# EAGLE design redashboard_rp2040 (EAGLE 9.6.2)
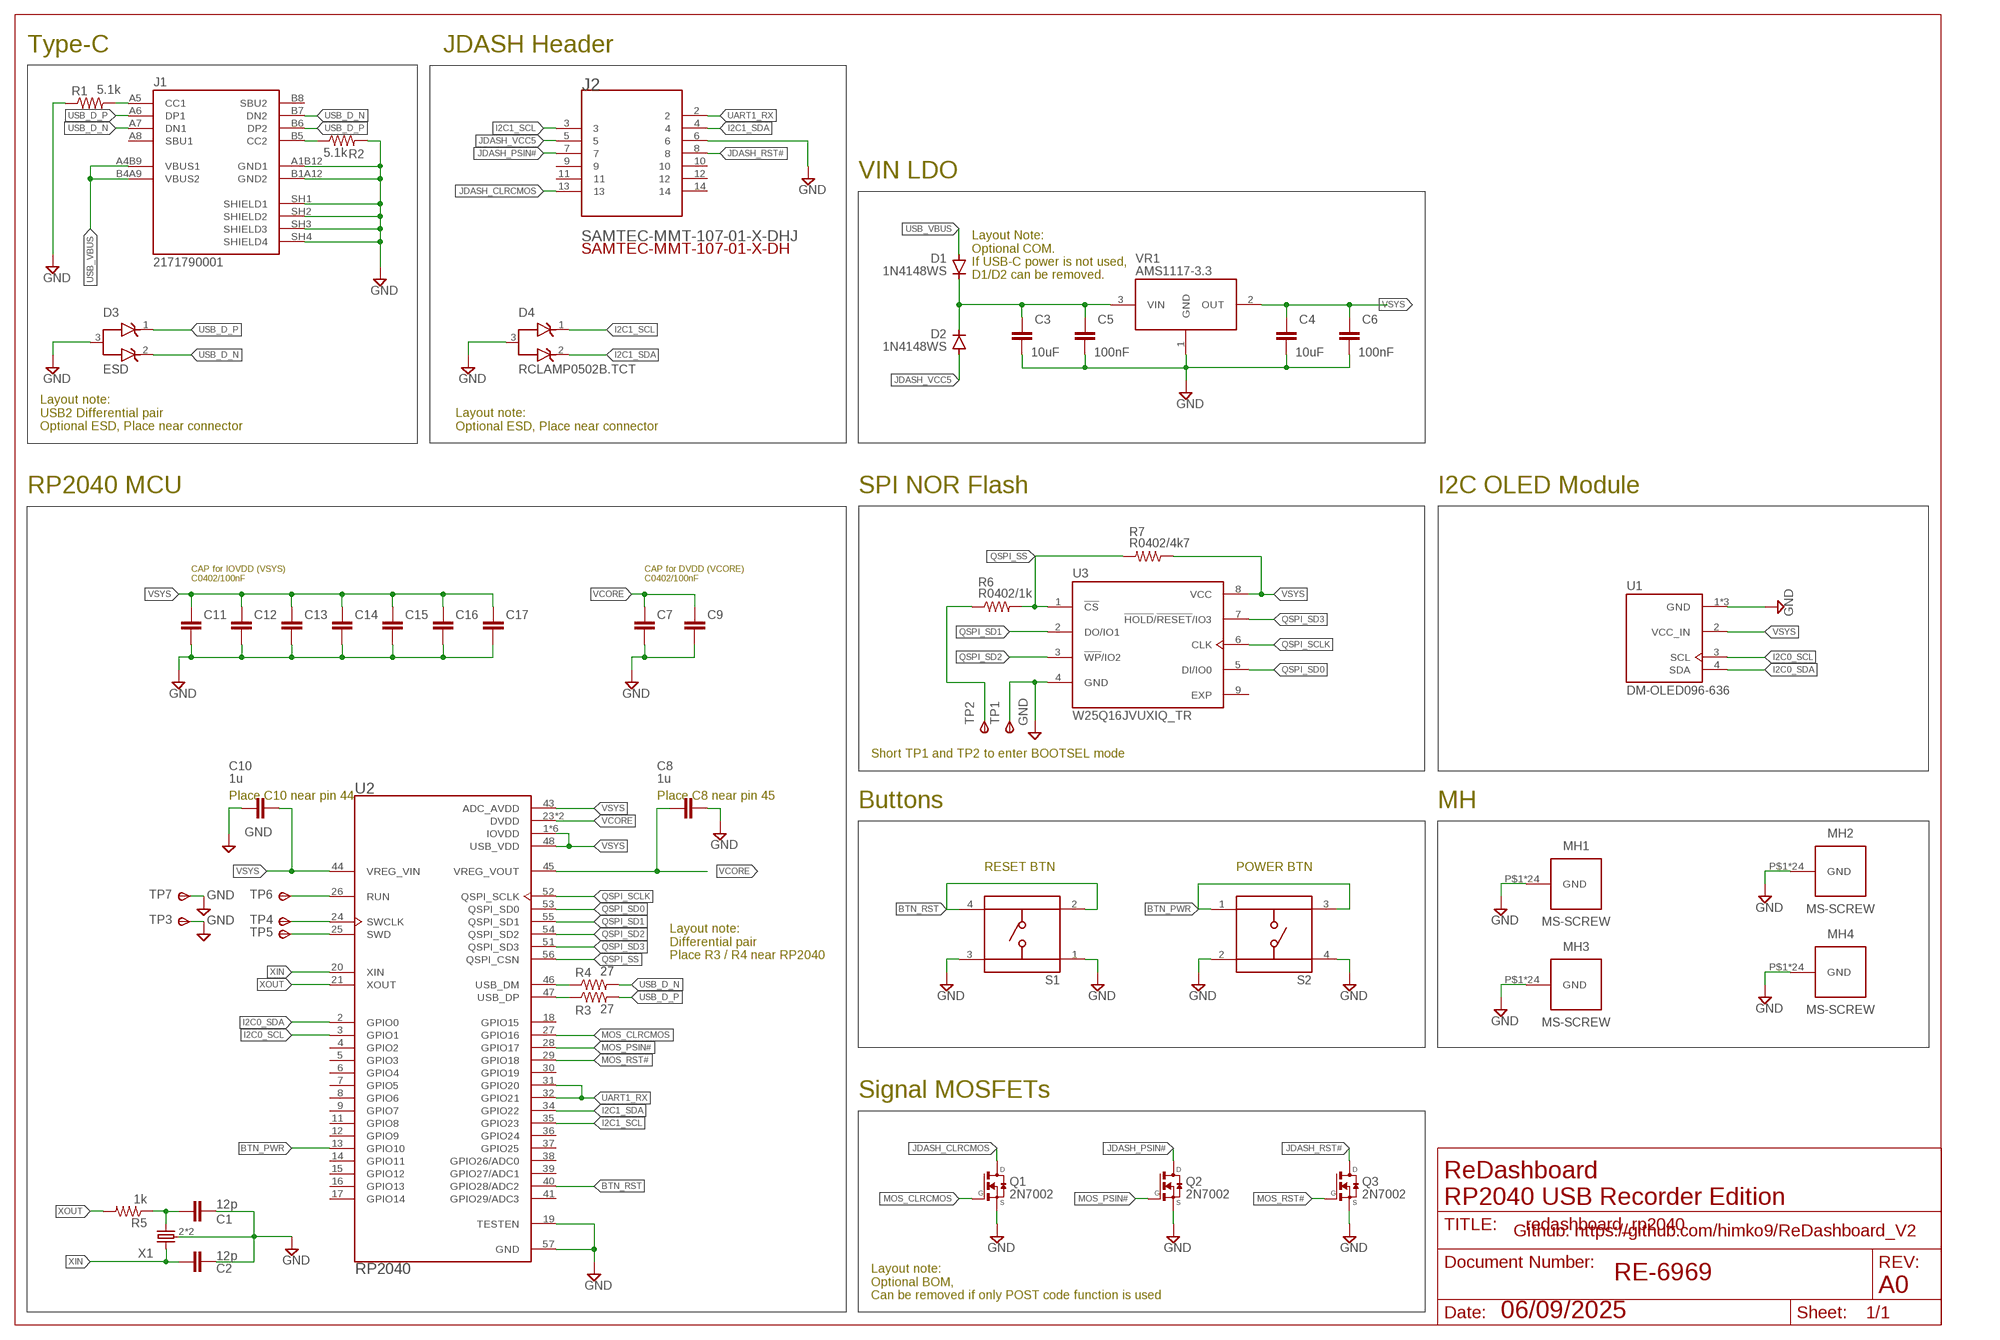
[diagram p0: schematic, sheet 1]

## Parts
C1  12p  CC0402JRNPO9BN100  [CAP_0402]
C2  12p  CC0402JRNPO9BN100  [CAP_0402]
C3  10uF  CC0603JRNPO9BN270  [CAP_0603]
C4  10uF  CC0603JRNPO9BN270  [CAP_0603]
C5  100nF  CC0402CRNPO9BN1R0  [CAP_0402]
C6  100nF  CC0402CRNPO9BN1R0  [CAP_0402]
C7  100nF  CC0402CRNPO9BN1R0  [CAP_0402]
C8  1u  CC0402CRNPO9BN1R0  [CAP_0402]
C9  CC0402CRNPO9BN1R0  [CAP_0402]
C10  1u  CC0402CRNPO9BN1R0  [CAP_0402]
C11  100nF  CC0402CRNPO9BN1R0  [CAP_0402]
C12  100nF  CC0402CRNPO9BN1R0  [CAP_0402]
C13  100nF  CC0402CRNPO9BN1R0  [CAP_0402]
C14  100nF  CC0402CRNPO9BN1R0  [CAP_0402]
C15  100nF  CC0402CRNPO9BN1R0  [CAP_0402]
C16  100nF  CC0402CRNPO9BN1R0  [CAP_0402]
C17  100nF  CC0402CRNPO9BN1R0  [CAP_0402]
D1  1N4148WS  [SOD-323]
D2  1N4148WS  [SOD-323]
D3  ESD  RCLAMP0502B.TCT  [TVS_RCLAMP0502B.TCT]
D4  RCLAMP0502B.TCT  [TVS_RCLAMP0502B.TCT]
J1  2171790001  [MOLEX_2171790001]
J2  SAMTEC-MMT-107-01-X-DHJ  [SAMTEC-MMT-107-01-X-DH]
MH1  MS-SCREW  [MS-SCREW]
MH2  MS-SCREW  [MS-SCREW]
MH3  MS-SCREW  [MS-SCREW]
MH4  MS-SCREW  [MS-SCREW]
Q1  2N7002  TRANSISTOR-FET_DMN2004K  [TRANSISTOR-FET_SOT23]
Q2  2N7002  TRANSISTOR-FET_DMN2004K  [TRANSISTOR-FET_SOT23]
Q3  2N7002  TRANSISTOR-FET_DMN2004K  [TRANSISTOR-FET_SOT23]
R1  5.1k  RC0402JR-070RL  [RES_0402]
R2  5.1k  RC0402JR-070RL  [RES_0402]
R3  27  RC0402JR-070RL  [RES_0402]
R4  27  RC0402JR-070RL  [RES_0402]
R5  1k  RC0402JR-070RL  [RES_0402]
R6  R0402/1k  RC0402JR-070RL  [RES_0402]
R7  R0402/4k7  RC0402JR-070RL  [RES_0402]
S1  TS04-66-50-BK-260-SMT  [SW_TS04-66-50-BK-260-SMT]
S2  TS04-66-50-BK-260-SMT  [SW_TS04-66-50-BK-260-SMT]
TP1  TPSTP10SQ  [TP10SQ]
TP2  TPSTP10R  [TP10R]
TP3  TPSTP10SQ  [TP10SQ]
TP4  TPSTP10R  [TP10R]
TP5  TPSTP10R  [TP10R]
TP6  TPSTP10R  [TP10R]
TP7  TPSTP10SQ  [TP10SQ]
U1  DM-OLED096-636  [MODULE_DM-OLED096-636]
U2  RP2040  [QFN40P700X700X90-57N]
U3  W25Q16JVUXIQ_TR  [IC_W25Q16JVUXIQ_TR]
VR1  AMS1117-3.3  AZ1117CR2-5.0TRG1  [VREG_AZ1117CR2-5.0TRG1]
X1  KX-6  [2.5X2.0_KX-6]

## Nets
BTN_PWR: S2.1 S2.3 U2.13(GPIO10)
BTN_RST: S1.2 S1.4 U2.40(GPIO28/ADC2)
GND: C1.2 C2.2 C3.2 C4.2 C5.2 C6.2 C7.2 C8.2 C9.2 C10.1 C11.2 C12.2 C13.2 C14.2 C15.2 C16.2 C17.2 D3.3(A) D4.3(A) J1.A1B12(GND1) J1.B1A12(GND2) J1.SH1(SHIELD1) J1.SH2(SHIELD2) J1.SH3(SHIELD3) J1.SH4(SHIELD4) J2.6 MH1.P$1(GND) MH1.P$2(GND) MH1.P$3(GND) MH1.P$4(GND) MH1.P$5(GND) MH1.P$6(GND) MH1.P$7(GND) MH1.P$8(GND) MH1.P$9(GND) MH1.P$10(GND) MH1.P$11(GND) MH1.P$12(GND) MH1.P$13(GND) MH1.P$14(GND) MH1.P$15(GND) MH1.P$16(GND) MH1.P$17(GND) MH1.P$18(GND) MH1.P$19(GND) MH1.P$20(GND) MH1.P$21(GND) MH1.P$22(GND) MH1.P$23(GND) MH1.P$24(GND) MH2.P$1(GND) MH2.P$2(GND) MH2.P$3(GND) MH2.P$4(GND) MH2.P$5(GND) MH2.P$6(GND) MH2.P$7(GND) MH2.P$8(GND) MH2.P$9(GND) MH2.P$10(GND) MH2.P$11(GND) MH2.P$12(GND) MH2.P$13(GND) MH2.P$14(GND) MH2.P$15(GND) MH2.P$16(GND) MH2.P$17(GND) MH2.P$18(GND) MH2.P$19(GND) MH2.P$20(GND) MH2.P$21(GND) MH2.P$22(GND) MH2.P$23(GND) MH2.P$24(GND) MH3.P$1(GND) MH3.P$2(GND) MH3.P$3(GND) MH3.P$4(GND) MH3.P$5(GND) MH3.P$6(GND) MH3.P$7(GND) MH3.P$8(GND) MH3.P$9(GND) MH3.P$10(GND) MH3.P$11(GND) MH3.P$12(GND) MH3.P$13(GND) MH3.P$14(GND) MH3.P$15(GND) MH3.P$16(GND) MH3.P$17(GND) MH3.P$18(GND) MH3.P$19(GND) MH3.P$20(GND) MH3.P$21(GND) MH3.P$22(GND) MH3.P$23(GND) MH3.P$24(GND) MH4.P$1(GND) MH4.P$2(GND) MH4.P$3(GND) MH4.P$4(GND) MH4.P$5(GND) MH4.P$6(GND) MH4.P$7(GND) MH4.P$8(GND) MH4.P$9(GND) MH4.P$10(GND) MH4.P$11(GND) MH4.P$12(GND) MH4.P$13(GND) MH4.P$14(GND) MH4.P$15(GND) MH4.P$16(GND) MH4.P$17(GND) MH4.P$18(GND) MH4.P$19(GND) MH4.P$20(GND) MH4.P$21(GND) MH4.P$22(GND) MH4.P$23(GND) MH4.P$24(GND) Q1.2(S) Q2.2(S) Q3.2(S) R1.1 R2.2 S1.1 S1.3 S2.2 S2.4 TP1.TP(PP) TP3.TP(PP) TP7.TP(PP) U1.1(GND) U1.S3(GND) U1.S4(GND) U2.19(TESTEN) U2.57(GND) U3.4(GND) VR1.1(GND) X1.2 X1.4
I2C0_SCL: U1.3(SCL) U2.3(GPIO1)
I2C0_SDA: U1.4(SDA) U2.2(GPIO0)
I2C1_SCL: D4.1(K1) J2.3 U2.35(GPIO23)
I2C1_SDA: D4.2(K2) J2.4 U2.34(GPIO22)
JDASH_CLRCMOS: J2.13 Q1.3(D)
JDASH_PSIN#: J2.7 Q2.3(D)
JDASH_RST#: J2.8 Q3.3(D)
JDASH_VCC5: D2.A J2.5
MOS_CLRCMOS: Q1.1(G) U2.27(GPIO16)
MOS_PSIN#: Q2.1(G) U2.28(GPIO17)
MOS_RST#: Q3.1(G) U2.29(GPIO18)
N$1: R6.1 TP2.TP(PP)
N$2: C3.1 C5.1 D1.C D2.C VR1.3(VIN)
N$3: J1.B5(CC2) R2.1
N$4: C1.1 R5.1 X1.3
N$5: J1.A5(CC1) R1.2
N$9: TP6.TP(PP) U2.26(RUN)
N$10: TP4.TP(PP) U2.24(SWCLK)
N$11: TP5.TP(PP) U2.25(SWD)
QSPI_SCLK: U2.52(QSPI_SCLK) U3.6(CLK)
QSPI_SD0: U2.53(QSPI_SD0) U3.5(DI/IO0)
QSPI_SD1: U2.55(QSPI_SD1) U3.2(DO/IO1)
QSPI_SD2: U2.54(QSPI_SD2) U3.3(!WP!/IO2)
QSPI_SD3: U2.51(QSPI_SD3) U3.7(!HOLD!/!RESET!/IO3)
QSPI_SS: R6.2 R7.2 U2.56(QSPI_CSN) U3.1(!CS)
UART1_RX: J2.2 U2.31(GPIO20) U2.32(GPIO21)
USB_D_N: D3.2(K2) J1.A7(DN1) J1.B7(DN2) R4.2
USB_D_P: D3.1(K1) J1.A6(DP1) J1.B6(DP2) R3.2
USB_D_R_N: R4.1 U2.46(USB_DM)
USB_D_R_P: R3.1 U2.47(USB_DP)
USB_VBUS: D1.A J1.A4B9(VBUS1) J1.B4A9(VBUS2)
VCORE: C7.1 C8.1 C9.1 U2.23(DVDD) U2.45(VREG_VOUT) U2.50(DVDD)
VSYS: C4.1 C6.1 C10.2 C11.1 C12.1 C13.1 C14.1 C15.1 C16.1 C17.1 R7.1 U1.2(VCC_IN) U2.1(IOVDD) U2.10(IOVDD) U2.22(IOVDD) U2.33(IOVDD) U2.42(IOVDD) U2.43(ADC_AVDD) U2.44(VREG_VIN) U2.48(USB_VDD) U2.49(IOVDD) U3.8(VCC) VR1.2(OUT)
XIN: C2.1 U2.20(XIN) X1.1
XOUT: R5.2 U2.21(XOUT)
Unconnected: J1.A8(SBU1) J1.B8(SBU2) J2.9 J2.10 J2.11 J2.12 J2.14 U2.4(GPIO2) U2.5(GPIO3) U2.6(GPIO4) U2.7(GPIO5) U2.8(GPIO6) U2.9(GPIO7) U2.11(GPIO8) U2.12(GPIO9) U2.14(GPIO11) U2.15(GPIO12) U2.16(GPIO13) U2.17(GPIO14) U2.18(GPIO15) U2.30(GPIO19) U2.36(GPIO24) U2.37(GPIO25) U2.38(GPIO26/ADC0) U2.39(GPIO27/ADC1) U2.41(GPIO29/ADC3) U3.9(EXP)

## Notes on the sheet
- Type-C | JDASH Header
- VIN LDO
- Layout Note:
  Optional COM.
  If USB-C power is not used,
  D1/D2 can be removed.
- Layout note: 
  USB2 Differential pair
  Optional ESD, Place near connector
- Layout note: 
  Optional ESD, Place near connector
- RP2040 MCU | SPI NOR Flash | I2C OLED Module
- CAP for IOVDD (VSYS) | CAP for DVDD (VCORE)
- C0402/100nF | C0402/100nF
- Short TP1 and TP2 to enter BOOTSEL mode
- Place C10 near pin 44 | Place C8 near pin 45
- Buttons | MH
- RESET BTN | POWER BTN
- Layout note: 
  Differential pair
  Place R3 / R4 near RP2040
- Signal MOSFETs
- ReDashboard 
  RP2040 USB Recorder Edition
- Github: https://github.com/himko9/ReDashboard_V2
- RE-6969
- A0
- Layout note: 
  Optional BOM, 
  Can be removed if only POST code function is used
- 06/09/2025

## Library data of the parts
C1 C2 = Resistor_Capacitor:CC0402JRNPO9BN100: CAP CER 10PF 50V C0G/NPO 0402 Manufacturer's datasheet <http://www.yageo.com/documents/recent/UPY-GP_NP0_16V-to-50V_16.pdf>; CREATED_BY: PCBLayout.com; DIGIKEY_PART_NUMBER: 311-1014-2-ND; MANUFACTURER: Yageo; MPN: CC0402JRNPO9BN100; PACKAGE: SMD 0402
C3 C4 = Resistor_Capacitor:CC0603JRNPO9BN270: CAP CER 27PF 50V C0G/NPO 0603 Manufacturer's datasheet <http://www.yageo.com/documents/recent/UPY-GP_NP0_16V-to-50V_16.pdf>; CREATED_BY: PCBLayout.com; DIGIKEY_PART_NUMBER: 311-1063-2-ND; MANUFACTURER: Yageo; MPN: CC0603JRNPO9BN270; PACKAGE: SMD 0603
C5-C17 = Resistor_Capacitor:CC0402CRNPO9BN1R0: CAP CER 1PF 50V C0G/NPO 0402 Manufacturer's datasheet <http://www.yageo.com/documents/recent/UPY-GP_NP0_16V-to-50V_16.pdf>; CREATED_BY: PCBLayout.com; DIGIKEY_PART_NUMBER: 311-2076-2-ND; MANUFACTURER: Yageo; MPN: CC0402CRNPO9BN1R0; PACKAGE: SMD 0402
D1 D2 = Diodes:1N4148WS: DIODE GEN PURP 75V 150MA SOD323F Manufacturer's datasheet <https://www.onsemi.com/pub/Collateral/1N914BWS-D.pdf>; CREATED_BY: PCBLayout.com; DIGIKEY_PART_NUMBER: 1N4148WSFSTR-ND; MANUFACTURER: Diodes Incorporated; MPN: 1N4148WS; PACKAGE: SOD-323
D3 D4 = MSI_EZDashboard:RCLAMP0502B.TCT: Check availability <https://pricing.snapeda.com/parts/RCLAMP0502B.TCT/Semtech%20Corporation/view-part?ref=eda>; AVAILABILITY: In Stock; CHECK_PRICES: https://www.snapeda.com/parts/RCLAMP0502B.TCT/Semtech/view-part/?ref=eda; DESCRIPTION: 25V Clamp 5A (8/20µs) Ipp Tvs Diode Surface Mount SC-75 (SOT523); MF: Semtech Corporation; MP: RCLAMP0502B.TCT; PACKAGE: SC-75 Semtech; PRICE: None; SNAPEDA_LINK: https://www.snapeda.com/parts/RCLAMP0502B.TCT/Semtech/view-part/?ref=snap
J1 = MSI_EZDashboard:2171790001: Check availability <https://pricing.snapeda.com/parts/2171790001/Molex/view-part?ref=eda>; AVAILABILITY: In Stock; CHECK_PRICES: https://www.snapeda.com/parts/2171790001/Molex/view-part/?ref=eda; DESCRIPTION: Universal Serial Bus (USB) Shielded I/O Receptacle, Type C, Right-Angle, Surface Mount, Top Mount, Single Row, 16 Circuits, Gold (Au) Plating; MF: Molex; MP: 2171790001; PACKAGE: None; PRICE: None; SNAPEDA_LINK: https://www.snapeda.com/parts/2171790001/Molex/view-part/?ref=snap
J2 = MSI_EZDashboard:SAMTEC-MMT-107-01-X-DH: Check availability <https://pricing.snapeda.com/parts/MMT-107-01-S-DH-P-TR/Samtec/view-part?ref=eda>; AVAILABILITY: In Stock; CHECK_PRICES: https://www.snapeda.com/parts/MMT-107-01-S-DH-P-TR/Samtec/view-part/?ref=eda; DESCRIPTION: Connector Header Surface Mount, Right Angle 14 position 0.079 (2.00mm); MF: Samtec; MP: MMT-107-01-S-DH-P-TR; PACKAGE: None; PRICE: None; SNAPEDA_LINK: https://www.snapeda.com/parts/MMT-107-01-S-DH-P-TR/Samtec/view-part/?ref=snap
MH1-MH4 = MSI_EZDashboard:MS-SCREW
Q1-Q3 = 52101-101-REV-A_v16:TRANSISTOR-FET_DMN2004K: N-Channel Enhancement MOSFET
R1-R7 = Resistor_Capacitor:RC0402JR-070RL: RES SMD 0 OHM JUMPER 1/16W 0402 Manufacturer's datasheet <http://www.yageo.com/documents/recent/PYu-RC_Group_51_RoHS_L_10.pdf>; CREATED_BY: PCBLayout.com; DIGIKEY_PART_NUMBER: 311-0.0JRTR-ND; MANUFACTURER: Yageo; MPN: RC0402JR-070RL; PACKAGE: SMD 0402
S1 S2 = MSI_EZDashboard:TS04-66-50-BK-260-SMT: Check availability <https://pricing.snapeda.com/parts/TS04-66-50-BK-260-SMT/Same%20Sky/view-part?ref=eda>; AVAILABILITY: In Stock; CHECK_PRICES: https://www.snapeda.com/parts/TS04-66-50-BK-260-SMT/Same+Sky/view-part/?ref=eda; DESCRIPTION: 6 x 6 mm, 5 mm Actuator Height, 260 gf, Black, Surface Mount, SPST, Tactile Switch; MF: Same Sky; MP: TS04-66-50-BK-260-SMT; PACKAGE: None; PRICE: None; SNAPEDA_LINK: https://www.snapeda.com/parts/TS04-66-50-BK-260-SMT/Same+Sky/view-part/?ref=snap
TP1-TP7 = testpad:TPS: TEST PIN
U1 = MSI_EZDashboard:DM-OLED096-636: Check availability <https://pricing.snapeda.com/parts/DM-OLED096-636/Display%20Module/view-part?ref=eda>; AVAILABILITY: Not in stock; CHECK_PRICES: https://www.snapeda.com/parts/DM-OLED096-636/Display+Module/view-part/?ref=eda; DESCRIPTION: 0.96” 128 X 64 MONOCHROME GRAPHIC OLED DISPLAY MODULE - I2C; MF: Display Module; MP: DM-OLED096-636; PACKAGE: Package; PRICE: None; SNAPEDA_LINK: https://www.snapeda.com/parts/DM-OLED096-636/Display+Module/view-part/?ref=snap
U2 = MSI_EZDashboard:RP2040: Check availability <https://pricing.snapeda.com/parts/RP2040/Raspberry%20Pi/view-part?ref=eda>; AVAILABILITY: In Stock; CHECK_PRICES: https://www.snapeda.com/parts/RP2040/Raspberry+Pi/view-part/?ref=eda; DESCRIPTION: RP2040 chip for Raspberry Pi Pico - ARM® Cortex®-M0+ MCU 32-Bit; MF: Raspberry Pi; MP: RP2040; PACKAGE: None; PRICE: None; SNAPEDA_LINK: https://www.snapeda.com/parts/RP2040/Raspberry+Pi/view-part/?ref=snap
U3 = MSI_EZDashboard:W25Q16JVUXIQ_TR: Check availability <https://pricing.snapeda.com/parts/W25Q16JVUXIQ%20TR/Winbond/view-part?ref=eda>; AVAILABILITY: In Stock; CHECK_PRICES: https://www.snapeda.com/parts/W25Q16JVUXIQ%20TR/Winbond/view-part/?ref=eda; DESCRIPTION: NOR Flash Serial (SPI, Dual SPI, Quad SPI) 3V/3.3V 16M-bit 2M x 8 6ns 8-Pin USON EP T/R; MF: Winbond; MP: W25Q16JVUXIQ TR; PACKAGE: UFDFN-8 Winbond; PRICE: None; SNAPEDA_LINK: https://www.snapeda.com/parts/W25Q16JVUXIQ%20TR/Winbond/view-part/?ref=snap
VR1 = MSI_EZDashboard:AZ1117CR2-5.0TRG1: Check availability <https://pricing.snapeda.com/parts/AZ1117CR2-5.0TRG1/Diodes%20Zetex/view-part?ref=eda>; AVAILABILITY: In Stock; CHECK_PRICES: https://www.snapeda.com/parts/AZ1117CR2-5.0TRG1/Diodes+Inc./view-part/?ref=eda; DESCRIPTION: Linear Voltage Regulator IC Positive Fixed 1 Output 1A SOT-89-3; MF: Diodes Zetex; MP: AZ1117CR2-5.0TRG1; PACKAGE: None; PRICE: None; SNAPEDA_LINK: https://www.snapeda.com/parts/AZ1117CR2-5.0TRG1/Diodes+Inc./view-part/?ref=snap
X1 = MSI_EZDashboard:KX

## Board
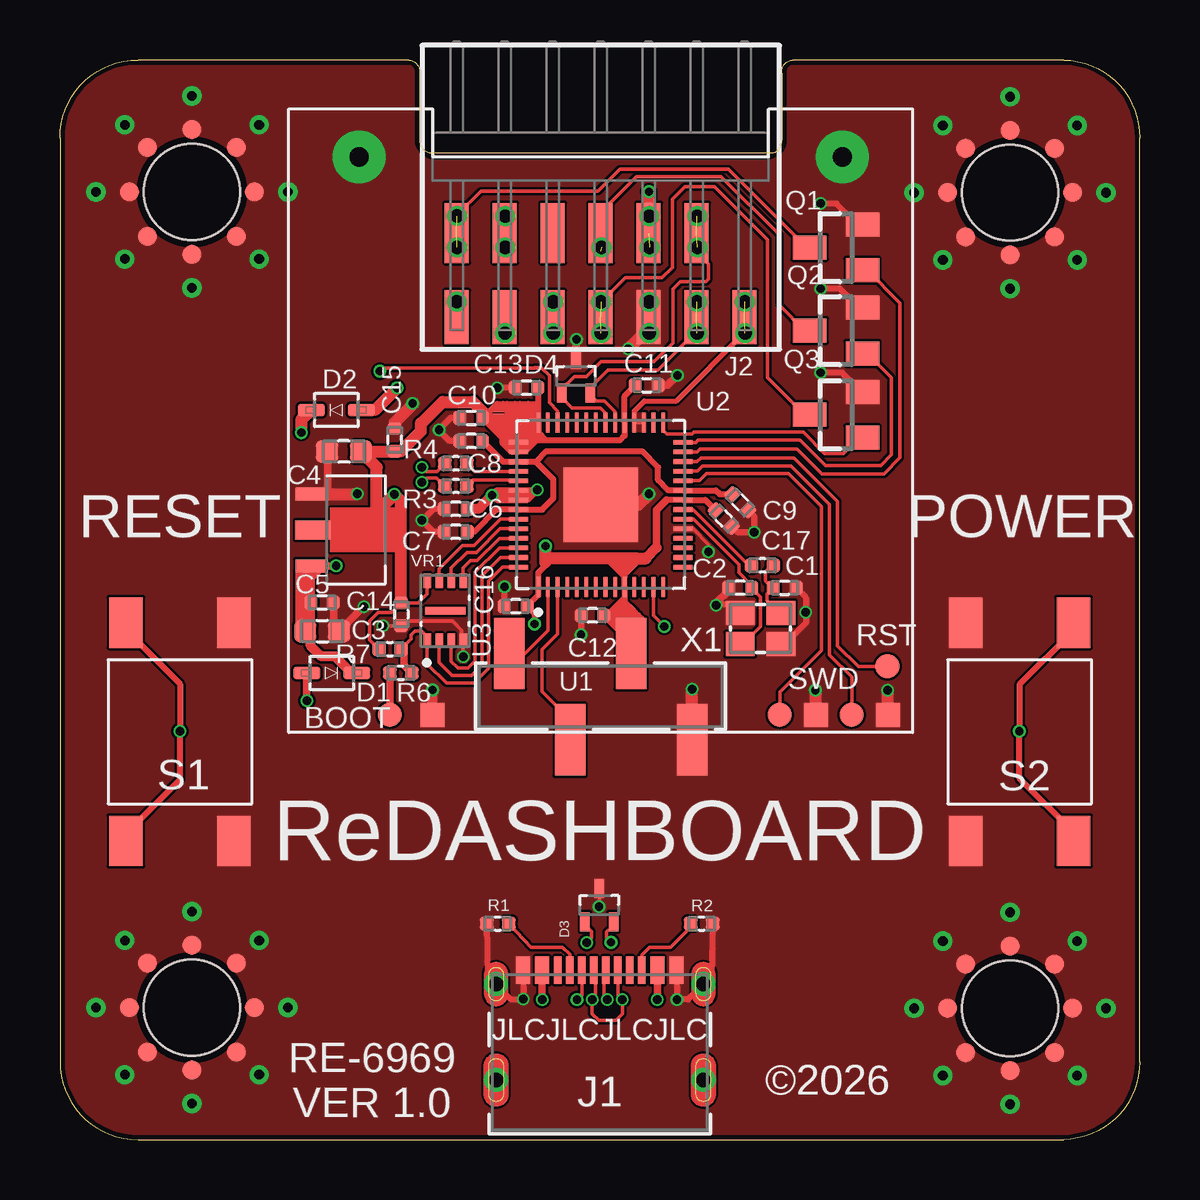
[diagram p1: board, top side]
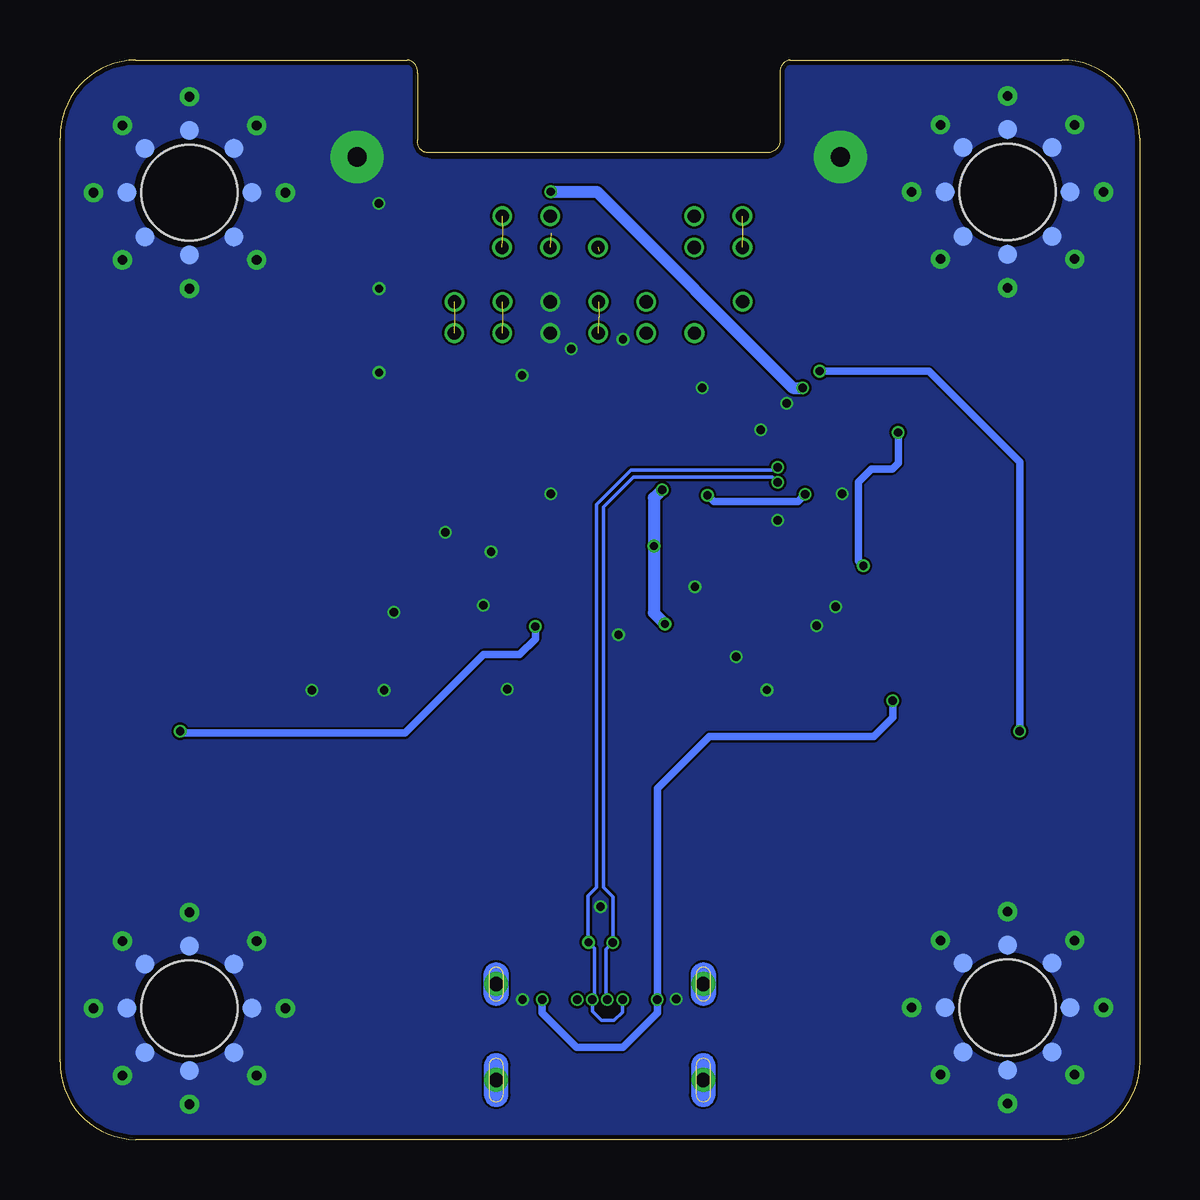
[diagram p2: board, bottom side, seen from below]

Size 45 x 45 mm. Coordinates in mm from the lower left corner, seen from the top.
Outline: 3.25,0 41.85,0 arc90 45,3.25 45,41.75 arc90 41.85,45 30.54,45 arc90 30.09,44.45 30.09,41.65 arc-90 29.69,41.13 15.49,41.13 arc-90 14.99,41.66 14.99,44.46 arc90 14.55,45 3.25,45 arc90 0,41.75 0,3.25 arc90 3.25,0
Copper layers (1*16): Top 0.035mm / dielectric 1.465mm / Bottom 0.035mm
Design rules "JLC0216 *": minimum track width 4mil, minimum drill 0.15mm, track to track 4mil, track to pad 4mil, pad to pad 4mil, via to via 4mil, smd to smd 4mil, copper to edge 0.2mm, drill to drill 6mil, minimum pad ring 2mil, minimum via ring 2mil, stop-mask expansion 0mil, vias tented up to drill 0mil, thermal gap 0mil

### Footprints (pad centres in the part's own frame; a part is rotated, then mirrored left to right if it is on the bottom)
CAP_0402 = smd 0.55 x 0.58: 1 -0.475,0; 2 0.475,0
CAP_0603 = smd 0.92 x 0.93: 1 -0.705,0; 2 0.705,0
SOD-323 = smd 1.14 x 0.52: A 1.04,0; C -1.04,0
TVS_RCLAMP0502B.TCT = smd 0.8 x 0.4: 1 -0.7,0.6; 2 -0.7,-0.6; 3 0.7,0
MOLEX_2171790001 = smd 0.59 x 1.15: A1B12 -3.2,3.425; A4B9 -2.4,3.425; B1A12 3.2,3.425; B4A9 2.4,3.425 | smd 0.298 x 1.15: A5 -1.25,3.425; A6 -0.25,3.425; A7 0.25,3.425; A8 1.25,3.425; B5 1.75,3.425; B6 0.75,3.425; B7 -0.75,3.425; B8 -1.75,3.425 | drill 0.6 pad 1: SH1 -4.32,-1.15; SH2 4.32,-1.15; SH3 -4.32,2.85; SH4 4.32,2.85
SAMTEC-MMT-107-01-X-DH = smd 1 x 2.25: 2 -6,6.68; 4 -4,6.68; 6 -2,6.68; 8 0,6.68; 10 2,6.68; 12 4,6.68; 14 6,6.68 | smd 1 x 2.5: 3 -4,3.175; 5 -2,3.175; 7 0,3.175; 9 2,3.175; 11 4,3.175; 13 6,3.175
MS-SCREW = drill 0.4 pad 0.8: P$1 0,-4; P$2 0,4; P$3 4,0; P$4 -2.8,2.8; P$5 -4,0; P$6 -2.8,-2.8; P$15 2.8,2.8; P$16 2.8,-2.8 | smd 0.8 x 0.8 bottom: P$7 0,2.6; P$8 0,-2.6; P$9 2.6,0; P$10 -1.85,1.85; P$11 1.85,1.85; P$12 -2.6,0; P$13 -1.85,-1.85; P$14 1.85,-1.85 | smd 0.8 x 0.8: P$17 0,2.6; P$18 1.85,1.85; P$19 2.6,0; P$20 1.85,-1.85; P$21 0,-2.6; P$22 -1.85,-1.85; P$23 -2.6,0; P$24 -1.85,1.85 | hole 4: 0,0
TRANSISTOR-FET_SOT23 = smd 1 x 1.4: 1 -0.95,-1.1; 2 0.95,-1.1; 3 0,1.1
RES_0402 = smd 0.58 x 0.58: 1 -0.46,0; 2 0.46,0
SW_TS04-66-50-BK-260-SMT = smd 2.1 x 1.4: 1 -4.55,2.25; 2 -4.55,-2.25; 3 4.55,2.25; 4 4.55,-2.25
TP10SQ = smd 1 x 1: TP 0,0
TP10R = smd 1 x 1: TP 0,0
MODULE_DM-OLED096-636 = smd 1.27 x 2.972: 1 -3.81,13.3; 2 -1.27,9.7; 3 1.27,13.3; 4 3.81,9.7 | drill 0.8 pad 2.2: S3 10.075,-11; S4 -10.075,-11
QFN40P700X700X90-57N = smd 0.84 x 0.2: 1 -3.435,2.6; 2 -3.435,2.2; 3 -3.435,1.8; 4 -3.435,1.4; 5 -3.435,1; 6 -3.435,0.6; 7 -3.435,0.2; 8 -3.435,-0.2; 9 -3.435,-0.6; 10 -3.435,-1; 11 -3.435,-1.4; 12 -3.435,-1.8; 13 -3.435,-2.2; 14 -3.435,-2.6; 29 3.435,-2.6; 30 3.435,-2.2; 31 3.435,-1.8; 32 3.435,-1.4; 33 3.435,-1; 34 3.435,-0.6; 35 3.435,-0.2; 36 3.435,0.2; 37 3.435,0.6; 38 3.435,1; 39 3.435,1.4; 40 3.435,1.8; 41 3.435,2.2; 42 3.435,2.6 | smd 0.2 x 0.84: 15 -2.6,-3.435; 16 -2.2,-3.435; 17 -1.8,-3.435; 18 -1.4,-3.435; 19 -1,-3.435; 20 -0.6,-3.435; 21 -0.2,-3.435; 22 0.2,-3.435; 23 0.6,-3.435; 24 1,-3.435; 25 1.4,-3.435; 26 1.8,-3.435; 27 2.2,-3.435; 28 2.6,-3.435; 43 2.6,3.435; 44 2.2,3.435; 45 1.8,3.435; 46 1.4,3.435; 47 1,3.435; 48 0.6,3.435; 49 0.2,3.435; 50 -0.2,3.435; 51 -0.6,3.435; 52 -1,3.435; 53 -1.4,3.435; 54 -1.8,3.435; 55 -2.2,3.435; 56 -2.6,3.435 | smd 3.1 x 3.1: 57 0,0
IC_W25Q16JVUXIQ_TR = smd 0.6 x 0.3: 1 -1.25,0.75; 2 -1.25,0.25; 3 -1.25,-0.25; 4 -1.25,-0.75; 5 1.25,-0.75; 6 1.25,-0.25; 7 1.25,0.25; 8 1.25,0.75 | smd 0.3 x 1.7: 9 0,0
VREG_AZ1117CR2-5.0TRG1 = smd 1.3 x 0.55: 1 -1.875,1.5; 3 -1.875,-1.5 | smd 1.475 x 0.8: 2 -1.788,0
2.5X2.0_KX-6 = smd 1.2 x 1: 1 -0.85,-0.65; 2 0.85,-0.65; 3 0.85,0.65; 4 -0.85,0.65

### Placement (x,y rotation side)
C1  30.21,23 0 top
C2  28.35,23 180 top
C3  10.93,21.19 0 top
C4  11.84,28.68 180 top
C5  10.93,22.39 0 top
C6  16.5,26.29 180 top
C7  16.5,25.33 180 top
C8  17.14,29.12 180 top
C9  28.35,26.56 315 top
C10  17.14,30.08 0 top
C11  24.46,31.44 0 top
C12  22.2,21.85 180 top
C13  19.45,31.34 180 top
C14  14.22,21.89 270 top
C15  13.95,29.16 90 top
C16  19,22.23 180 top
C17  27.67,25.89 315 top
D1  11.33,19.45 180 top
D2  11.52,30.41 0 top
D3  22.48,9.77 90 top
D4  21.51,31.82 90 top
J1  22.5,3.63 0 top
J2  22.54,40.96 180 top
MH1  5.5,5.5 0 top
MH2  5.5,39.5 0 top
MH3  39.6,5.47 0 top
MH4  39.6,39.47 0 top
Q1  32.35,37.18 90 top
Q2  32.35,33.72 90 top
Q3  32.35,30.21 90 top
R1  18.25,9 0 top
R2  26.75,9 0 top
R3  16.5,27.24 180 top
R4  16.5,28.18 180 top
R5  29.28,23.93 180 top
R6  14.21,19.45 0 top
R7  13.76,20.44 0 top
S1  5,17 270 top
S2  40,17 270 top
TP1  15.53,17.7 0 top
TP2  13.75,17.7 0 top
TP3  31.5,17.7 0 top
TP4  30,17.7 0 top
TP5  33,17.7 0 top
TP6  34.49,19.72 0 top
TP7  34.5,17.7 0 top
U1  22.54,29.96 180 top
U2  22.54,26.46 90 top
U3  16.06,22.04 90 top
VR1  12.34,25.41 0 top
X1  29.2,21.3 0 top

### Tracks (layer width: path | path; a pad name or v marks a point on that pad's centre or on a via)
BTN_PWR  (via drill 0.35 pad 0.45)
  Top 0.152: U2.13 24.74,21.84 v25.19,21.39 v25.18,21.39 | S2.1 42.25,21.22 | S2.3 42.25,12.8
  Top 0.254: 42.25,21.22 39.99,18.96 v39.99,17.02 39.99,15.06 42.25,12.8
  Bottom 0.305: v25.18,21.39 25.18,20.88 25.85,20.21 27.35,20.21 30.62,16.94 39.91,16.94 v39.99,17.02
BTN_RST  (via drill 0.35 pad 0.45)
  Top 0.152: 19.79,32.17 20.07,32.17 20.08,32.16 | 20.08,32.16 13.46,32.16 v13.34,32.04 v13.34,32.03 | U2.40 20.74,30.37 20.4,30.71 20.4,31.84 20.08,32.16 | S1.2 2.75,21.23 | S1.4 2.75,12.77
  Top 0.254: 2.75,21.23 5,18.98 v5,17.02 5,15.02 2.75,12.77
  Bottom 0.305: v13.34,32.03 8.79,32.03 5,28.24 v5,17.02
GND  (via drill 0.35 pad 0.45, 0.55)
  Top 0.152: v16.81,20.12 U3.4 16.74,20.86 16.74,21.22 16.36,21.61 14.41,21.61 C14.2 v13.46,21.41 | 11.4,20.96 C3.2 | U2.19 26.38,25.46 27.03,24.81 v27.03,24.5 | D3.3 v22.48,9.71 v22.47,9.7 | 30.21,20.65 X1.2
  Top 0.203: J2.6 24.54,33.81
  Top 0.254: J1.B1A12 v25.72,5.84 26.18,5.84 J1.SH4 27.16,6.82 R2.2 | J1.A1B12 v19.32,5.85 18.81,5.85 J1.SH3 17.83,6.83 R1.1 | C7.2 15.57,25.33 v15.09,25.81 15.57,26.29 C6.2 | C8.2 16.23,29.12 15.8,29.55 v15.8,29.59 16.29,30.08 C10.1 | C13.2 v18.23,31.34 | C15.2 13.95,29.89 | v14.7,30.68 14.7,30.64 | C16.2 v18.52,23.05 v18.53,23.05 | C17.2 28.24,25.32 v28.93,25.32 28.93,25.98 C9.2 | C12.2 v21.73,21.05 v21.72,21.05 | C1.2 31.09,22.59 v31.09,21.98 v31.1,21.97 31.1,21.54 30.21,20.65 | 28.38,22.04 28.1,22.31 27.35,22.31 v27.35,22.27 | Q1.2 33.26,38.13 32.37,39.02 v31.71,39.02 | Q2.2 33.31,34.67 32.51,35.47 v31.7,35.47 | Q3.2 33.41,31.16 32.6,31.97 v31.7,31.97
  Top 0.305: C11.2 25.33,31.44 v25.74,31.85 | C5.2 11.4,21.42 C3.2 v12.65,22.21 v12.66,22.21 | VR1.1 10.89,26.91 11.16,27.18 11.16,28.65 C4.2 | v31.5,18.72 v31.49,18.73 | C2.2 27.88,22.89 27.35,22.36 v27.35,22.27 | v21.53,33.35 21.51,33.33 D4.3
  Top 0.406: TP1.TP v15.53,18.74
  Top 0.508: 10.89,26.91 v12.39,26.91 | 14.7,30.64 13.95,29.89 | U1.1 v26.35,18.77 | TP3.TP v31.5,18.72 | 24.54,33.81 v23.68,32.95 | U2.57 24.1,26.46 v24.55,26.91 | TP7.TP v34.5,18.73
  other vias: 24.56,33.62 24.56,34.92
  pour Top: 3.26,0.14 arc-90 0.08,3.32 0.08,41.62 arc-90 3.35,44.89 14.47,44.89 arc-90 14.92,44.39 14.92,41.53 arc90 15.61,40.84 29.45,40.84 arc90 30.15,41.54 30.15,44.45 arc-90 30.53,44.86 41.87,44.86 arc-90 44.88,41.75 44.88,3.32 arc-90 41.8,0.14
  pour Bottom: 3.23,0.17 arc-90 0.05,3.35 0.05,41.65 arc-90 3.32,44.92 14.44,44.92 arc-90 14.89,44.42 14.89,41.56 arc90 15.58,40.87 29.42,40.87 arc90 30.12,41.57 30.12,44.48 arc-90 30.5,44.89 41.84,44.89 arc-90 44.85,41.78 44.85,3.35 arc-90 41.77,0.17
I2C0_SCL
  Top 0.152: U1.3 21.27,17.5 20.1,18.67 20.1,20.43 20.74,21.07 U2.3
I2C0_SDA
  Top 0.152: U2.2 20.34,21.22 19.38,20.26 U1.4
I2C1_SCL  (via drill 0.55)  (2 unrouted)
  Top 0.152: J2.3 26.54,36.98 27.03,36.49 27.03,35.87 26.93,35.77 25.87,35.77 25.55,35.45 25.55,33.2 24.77,32.42 22.56,32.42 21.95,31.81 21.44,31.81 20.91,31.28 D4.1 20.91,30.94 21.35,30.5 22.53,30.5 22.74,30.29 U2.35
  other vias: 26.56,38.49 26.57,37.19
I2C1_SDA  (via drill 0.55)  (2 unrouted)
  Top 0.152: J2.4 26.54,33.69 24.92,32.07 22.85,32.07 22.04,31.26 D4.2 22.07,31.09 22.37,30.79 22.7,30.79 23.14,30.35 U2.34
  other vias: 26.55,34.92 26.56,33.62
JDASH_CLRCMOS  (via drill 0.55)  (2 unrouted)
  Top 0.152: Q1.3 31.13,37.18 27.86,40.45 23.34,40.45 22.43,39.54 17.55,39.54 16.54,38.53 J2.13
  other vias: 16.55,37.19 16.55,38.5
JDASH_PSIN#  (via drill 0.55)  (1 unrouted)
  Top 0.152: Q2.3 31.04,33.72 29.98,34.78 29.98,37.71 27.56,40.13 24.04,40.13 22.54,38.63 J2.7 22.54,37.03
  other vias: 22.57,37.19
JDASH_RST#  (via drill 0.55)  (2 unrouted)
  Top 0.152: Q3.3 31.04,30.21 29.49,31.76 29.49,37.52 27.29,39.72 26.06,39.72 25.53,39.19 25.53,36.35 25.1,35.92 23.57,35.92 22.54,34.89 J2.8
  other vias: 22.55,34.92 22.56,33.62
JDASH_VCC5  (via drill 0.35 pad 0.45, 0.55)  (1 unrouted)
  Top 0.508: J2.5 24.56,37.8 v24.56,38.49 v24.56,39.5 v24.55,39.51 | v14.05,31.33 13.13,30.41 D2.A
  Bottom 0.508: v24.55,39.51 22.62,39.51 14.44,31.33 v14.05,31.33
  other vias: 24.57,37.19
MOS_CLRCMOS
  Top 0.152: U2.27 26.56,28.66 26.68,28.78 30.72,28.78 31.75,27.75 34.34,27.75 35.02,28.43 35.02,34.87 33.66,36.23 Q1.1
MOS_PSIN#
  Top 0.152: U2.28 26.51,29.06 26.6,29.15 30.85,29.15 31.9,28.1 34.21,28.1 34.66,28.55 34.66,31.76 33.65,32.77 Q2.1
MOS_RST#
  Top 0.152: U2.29 25.14,29.56 25.3,29.4 26.34,29.4 26.42,29.48 30.98,29.48 31.87,28.59 32.65,28.59 33.32,29.26 Q3.1
N$1
  Top 0.305: TP2.TP R6.1
N$2  (via drill 0.35 pad 0.45)
  Top 0.152: 10.46,20.96 C3.1 | C5.1 10.45,22.38 10.22,22.38
  Top 0.203: 10.22,23.1 11.04,23.91 v11.51,23.91
  Top 0.305: 10.22,23.1 10.32,23.1 | VR1.3 v11.51,23.91
  Top 0.406: D1.C 12.16,19.45 11.47,20.14 10.89,20.14 10.46,20.58 10.46,20.96
  Top 0.508: 10.22,23.67 VR1.3 | D2.C 10.06,29.99 v10.06,29.47
  Top 0.813: C3.1 10.22,22.38 10.22,23.1 10.22,23.67
  Bottom 0.305: v11.51,23.91 11.71,24.11 11.71,27.41 11.17,27.95 10.3,27.95 10.06,28.19 v10.06,29.47
N$3
  Top 0.152: J1.B5 24.25,7.69 24.57,8.01 25.45,8.01 26.29,8.85 R2.1
N$4
  Top 0.152: R5.1 29.66,23.93 29.41,23.68 29.41,23.29 29.7,23 C1.1 29.48,22.74 29.48,22.46 29.9,22.04 29.99,21.95 X1.3
N$5
  Top 0.152: R1.2 19.64,8.01 20.95,8.01 21.25,7.71 J1.A5
N$9
  Top 0.152: U2.26 26.56,28.26 26.71,28.41 30.6,28.41 32.41,26.6 32.41,20.58 33.27,19.72 TP6.TP
N$10
  Top 0.152: U2.24 26.65,27.46 26.95,27.76 30.36,27.76 31.73,26.39 31.73,20.38 30,18.65 TP4.TP
N$11
  Top 0.152: U2.25 26.57,27.86 26.79,28.08 30.47,28.08 32.08,26.47 32.08,20.2 33,19.28 TP5.TP
N$28  (via drill 0.55)
  other vias: 16.54,34.93
N$33  (via drill 0.55)
  other vias: 18.56,38.49
N$34  (via drill 0.55)
  other vias: 18.56,37.19
N$41  (via drill 0.55)
  other vias: 18.55,33.62
N$42  (via drill 0.55)
  other vias: 20.56,33.62
N$43  (via drill 0.55)
  other vias: 20.56,34.92
QSPI_SCLK
  Top 0.152: U2.52 18.34,25.46 17.36,24.48 16.97,24.48 16.31,23.82 U3.6
QSPI_SD0
  Top 0.152: U2.53 18.31,25.06 17.39,24.14 17.12,24.14 16.81,23.83 U3.5
QSPI_SD1
  Top 0.152: U2.55 18.36,24.27 17.6,23.51 17.6,19.79 17.16,19.35 16.35,19.35 15.81,19.89 U3.2
QSPI_SD2
  Top 0.152: U3.3 16.31,19.93 16.59,19.65 17.01,19.65 17.31,19.95 17.31,23.65 18.32,24.66 U2.54
QSPI_SD3
  Top 0.152: U3.7 15.81,23.79 16.79,24.77 17.27,24.77 18.37,25.87 19.09,25.87 U2.51
QSPI_SS
  Top 0.152: U2.56 18.44,23.86 17.87,23.29 17.87,19.63 17.27,19.03 16.11,19.03 15.31,19.83 U3.1 15.31,20.96 15.07,21.2 14.8,21.2 14.64,21.04 14.64,20.86 R7.2
  Top 0.305: R7.2 14.35,20.31 14.35,19.77 R6.2
UART1_RX  (via drill 0.55)  (2 unrouted)
  Top 0.152: U2.31 U2.32
  Top 0.203: U2.32 23.94,30.37 24.36,30.79 25.69,30.79 28.54,33.64 J2.2
  other vias: 28.55,34.92 28.56,33.62
  pour Top: 24.44,29.48 23.84,29.48 23.84,30.31 24.15,30.31 24.44,30.31
USB_D_N  (via drill 0.35 pad 0.45)
  Top 0.152: R4.2 15.71,27.85 15.27,27.85 v15.09,28.03 | J1.A7 22.75,6.59 22.67,6.52 22.67,5.98 v22.81,5.84 | J1.B7 21.75,6.04 v21.55,5.84 | D3.2 22.98,8.85 22.78,8.65 22.78,8.41 v22.97,8.22
  Bottom 0.152: v15.09,28.03 15.22,27.9 21.19,27.9 22.63,26.46 22.63,10.51 23,10.15 23,8.25 v22.97,8.22 22.72,7.97 22.72,5.93 v22.81,5.84 22.81,5.34 22.43,4.96 21.9,4.96 21.55,5.31 v21.55,5.84
USB_D_P  (via drill 0.35 pad 0.45)
  Top 0.152: R3.2 15.7,27.58 15.28,27.58 v15.09,27.39 | J1.A6 22.25,6.61 22.33,6.53 22.33,5.99 v22.18,5.84 22.18,5.24 22.46,4.96 23.17,4.96 23.44,5.23 v23.44,5.84 23.25,6.03 J1.B6 | D3.1 21.98,8.85 22.16,8.67 22.16,8.52 22.16,8.41 v21.96,8.21
  Bottom 0.152: v15.09,27.39 15.31,27.61 21.09,27.61 22.34,26.36 22.34,10.52 21.94,10.12 21.94,8.23 v21.96,8.21 22.24,7.93 22.24,5.9 v22.18,5.84
USB_D_R_N
  Top 0.152: R4.1 17.29,27.84 18.72,27.84 18.73,27.85 U2.46
USB_D_R_P
  Top 0.152: R3.1 17.2,27.48 18.7,27.48 18.73,27.45 U2.47
USB_VBUS  (via drill 0.35 pad 0.45)
  Top 0.305: v10.29,18.29 D1.A | J1.A4B9 v20.1,5.84 | J1.B4A9 v24.9,5.84
  Bottom 0.305: v10.29,18.29 10.29,17.59 11.08,16.8 17.93,16.8 20.1,14.63 v20.1,5.84 20.1,5.29 21.54,3.85 23.46,3.85 24.9,5.29 v24.9,5.84
VCORE
  Top 0.254: C8.1 18.48,28.26 U2.45 19.83,28.26 | C7.1 17.27,25.33 18.2,26.26 U2.50 20.1,26.26 20.56,26.72 20.56,27.53 19.83,28.26 | C9.1 27.5,26.9 27.34,27.06 U2.23 25.35,27.06 24.93,27.48 24.93,28.02 24.26,28.69 20.27,28.69 19.84,28.26 19.83,28.26
VSYS  (via drill 0.35 pad 0.45)
  Top 0.152: C10.2 17.88,30.08 | U3.8 15.31,22.75 14.93,22.36 C14.1 | 19.57,22.23 C16.1 | C14.1 14.22,22.55 | R7.1 12.91,20.83 12.91,21.61 13.26,21.96 13.81,21.96 C14.1 | U2.43 19.13,29.04 19.13,28.68 U2.44
  Top 0.203: 18.83,28.66 U2.44 | 24.03,24.22 23.54,23.73 | 23.53,23.45 22.76,24.22
  Top 0.254: U2.48 18.21,27.06 v18.01,26.86 | v19.78,21.49 19.78,21.93 C16.1 19.94,22.7 U2.1 19.94,23.63 20.23,23.92 20.23,24.06 20.39,24.22 | C15.1 14.21,28.68 | 18.78,28.93 19.4,28.93 19.61,29.14 | 18.64,29.06 18.43,29.26 | 18.43,29.26 18.28,29.41 | 18.28,29.41 18.16,29.53 | 18.16,29.53 17.89,29.81 | C10.2 17.89,29.81 | U2.42 19.94,30.24 | 19.94,30.24 19.94,30.66 | 19.94,30.66 19.94,31.32 C13.1 | 18.43,29.26 18.43,29.06 18.8,28.68 19.13,28.68 19.39,28.68 | C10.2 17.64,30.08 17.98,30.42 | 17.98,30.42 18.23,30.66 18.48,30.66 | 19.94,30.24 19.52,30.66 | 18.48,30.66 18.63,30.66 | 18.63,30.66 18.96,30.66 | 18.96,30.66 19.18,30.66 | 19.18,30.66 19.52,30.66 | 19.52,30.66 19.94,30.66 | v18.01,26.86 18.21,26.66 U2.49 19.48,26.66 v19.9,27.08 | 25.28,26.66 U2.22 26.9,26.66 C17.1 | v19.9,27.08 v19.89,27.08 19.69,26.88 | U2.48 19.5,27.06 19.69,26.88 | 19.69,26.88 19.7,26.87 19.68,26.86 v18.01,26.86 | v19.9,27.08 19.88,27.06 U2.48 | 20.26,29.14 23.34,29.14 23.54,29.34 U2.33 23.54,31 C11.1 | 20.26,29.14 19.85,29.14 | 19.61,29.14 19.77,29.14 | 19.77,29.14 19.85,29.14 | U2.42 19.94,29.46 | 19.94,29.46 19.61,29.14 | 19.14,28.69 19.4,28.69 19.85,29.14 | 19.85,29.14 19.94,29.23 19.94,29.46 | 20.26,29.14 19.94,29.46 | 19.94,29.46 | 23.54,23.45 23.53,23.45 | 23.54,23.45 23.54,23.72 23.54,23.73 | U2.10 23.54,23.45 | U2.10 23.54,23.95 | U2.10 23.54,24.02 | U2.10 23.54,22.58 | 23.54,22.41 23.54,22.28 | 23.54,22.28 23.54,22.05 | 23.54,21.62 23.54,21.85 | 23.54,21.85 23.54,22.05 | 23.54,21.62 23.54,21.11 | 23.54,21.11 23.54,20.53 U1.2 | C12.1 22.81,21.85 23.54,22.58 | C12.1 23.41,21.11 23.54,21.11 | C12.1 22.91,21.62 23.54,21.62 | C12.1 23.11,21.85 | 23.11,21.85 23.54,22.28
  Top 0.254: 23.11,21.85 23.34,21.85 23.54,22.05 | 23.54,22.05 23.9,22.05 | 23.9,22.05 24.1,21.85 | 24.1,21.85 24.3,21.65 | 23.54,21.85 24.1,21.85 | 23.54,22.58 23.54,22.41 | 23.54,22.41 23.9,22.05 | U2.42 19.18,30.66 | 19.77,29.14 19.77,29.72 19.61,29.88 | 19.61,29.68 18.63,30.66 | 19.61,29.52 19.61,29.68 | 19.61,29.68 19.61,29.88 | 19.61,29.14 19.61,29.35 | 19.61,29.35 19.61,29.52 | 19.61,29.52 19.33,29.81 18.19,29.81 | 18.48,30.66 19.1,30.04 17.66,30.04 C10.2 | 19.55,29.41 19.32,29.65 | 18.8,30.16 19.32,29.65 | 18.8,30.16 18.55,30.42 17.98,30.42 | C10.2 17.7,30.16 18.8,30.16 | 19.61,29.14 19.49,29.26 18.43,29.26 | 18.28,29.41 19.55,29.41 | 19.55,29.41 19.61,29.35 | 17.89,29.81 18.19,29.81 | 18.16,29.53 19.2,29.53 19.32,29.65 | 19.32,29.65 18.35,29.65 18.19,29.81 | 18.96,30.66 19.61,30 19.61,29.88 | v20.23,24.73 v20.24,24.74
  Top 0.305: VR1.2 12.46,25.41 13.2,26.15 | 25.28,26.66 24.87,26.25 24.87,24.67
  Top 0.406: C6.1 17.44,26.29 17.74,26.59 v18.01,26.86 | 24.87,24.67 24.42,24.22
  Top 0.508: C15.1 C4.1 13.2,28.02 13.2,26.15 v13.94,26.89 14.22,26.61 14.22,22.55 | 17.88,30.08 17.21,30.75 15.95,30.75 15.05,29.85 15.05,29.53 14.21,28.68 | 24.04,24.22 24.03,24.22 23.74,24.22 | 24.04,24.22 24.42,24.22 | 23.74,24.22 23.27,24.22 | 23.27,24.22 23.04,24.22 | 23.04,24.22 22.76,24.22 20.39,24.22 | 23.04,24.22 23.54,23.72 24.04,24.22 | 23.54,23.95 23.27,24.22 | 23.54,24.02 23.74,24.22 | 20.23,24.06 v20.23,24.73
  Bottom 0.305: v13.94,26.89 14.24,26.59 17.74,26.59 v18.01,26.86
  Bottom 0.508: v19.9,27.08 20.24,26.74 v20.24,24.74 20.24,21.95 v19.78,21.49
XIN
  Top 0.152: U2.20 26.41,25.86 28.3,23.98 28.3,23.63 28.82,23.1 C2.1 29.2,22.62 29.2,21.39 28.46,20.65 X1.1
XOUT
  Top 0.152: U2.21 26.38,26.26 28.71,23.93 R5.2

### Text on the board
tNames: RESET | POWER | RST | SWD | BOOT | ReDASHBOARD | JLCJLCJLCJLC | RE-6969 / VER 1.0 | ©2026